# Altium project door-sensor-pcb-v3.PrjPcb
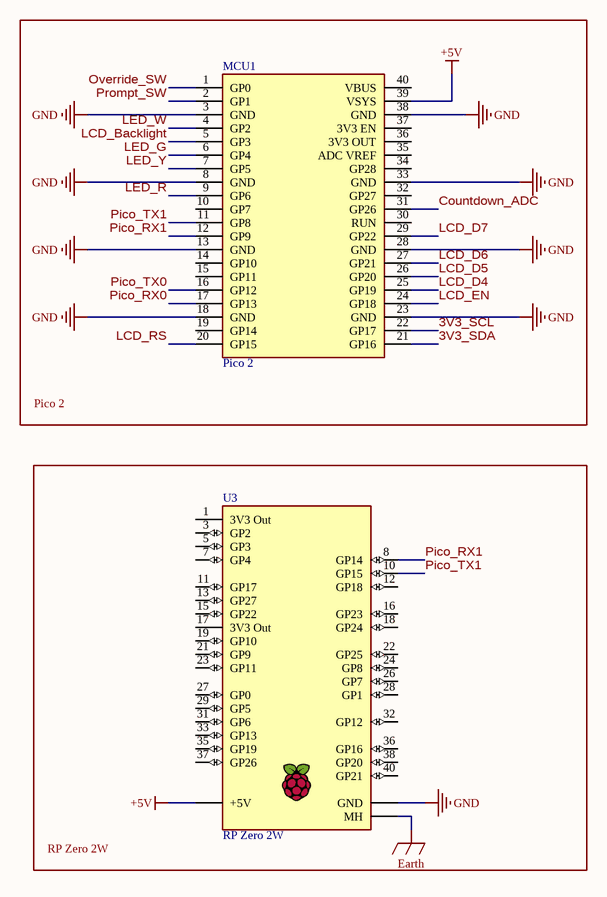
[diagram p0: Controllers.SchDoc]
5 sheets, 68 parts. Net scope: global (net labels, ports and power ports of the same name join across sheets).
Board file: Main.PcbDoc
Sheets:
  Controllers.SchDoc
  Power.SchDoc
  Connections.SchDoc
  Input Devices.SchDoc
  Output Devices.SchDoc

## Sheet Controllers.SchDoc
size A; SheetNumber: 1; SheetTotal: 5

### Parts
MCU1  Pico 2  [[Pi] Pico 2]
U3  RP Zero 2W  [[Pi] Zero 2W]

### Blocks framed on the sheet
Pico 2: MCU1
RP Zero 2W: U3

### Nets
+5V: MCU1.39(VSYS) U3.+5V
Earth: U3.MH
GND: MCU1.3(GND) MCU1.8(GND) MCU1.13(GND) MCU1.18(GND) MCU1.23(GND) MCU1.28(GND) MCU1.33(GND) MCU1.38(GND) U3.GND
3V3_SCL: MCU1.22(GP17)
3V3_SDA: MCU1.21(GP16)
Countdown_ADC: MCU1.31(GP26)
LCD_Backlight: MCU1.5(GP3)
LCD_D4: MCU1.25(GP19)
LCD_D5: MCU1.26(GP20)
LCD_D6: MCU1.27(GP21)
LCD_D7: MCU1.29(GP22)
LCD_EN: MCU1.24(GP18)
LCD_RS: MCU1.20(GP15)
LED_G: MCU1.6(GP4)
LED_R: MCU1.9(GP6)
LED_W: MCU1.4(GP2)
LED_Y: MCU1.7(GP5)
Override_SW: MCU1.1(GP0)
Pico_RX0: MCU1.17(GP13)
Pico_RX1: MCU1.12(GP9) U3.8(GP14)
Pico_TX0: MCU1.16(GP12)
Pico_TX1: MCU1.11(GP8) U3.10(GP15)
Prompt_SW: MCU1.2(GP1)

Not connected (* = marked no-connect by the designer): MCU1 10(GP7) 14(GP10) 15(GP11) 19(GP14) 30(RUN) 32(GP27) 34(GP28) 35(ADC_VREF) 36(3V3_OUT) 37(3V3_EN) 40(VBUS); U3 1(3V3_Out) 3(GP2) 5(GP3) 7(GP4) 11(GP17) 12(GP18) 13(GP27) 15(GP22) 16(GP23) 17(3V3_Out) 18(GP24) 19(GP10) 21(GP9) 22(GP25) 23(GP11) 24(GP8) 26(GP7) 27(GP0) 28(GP1) 29(GP5) 31(GP6) 32(GP12) 33(GP13) 35(GP19) 36(GP16) 37(GP26) 38(GP20) 40(GP21)

### Library data of the parts
MCU1 = [Pi] Pico 2: SC1631; Supplier 1: DigiKey; Supplier Part Number 1: 2648-SC1631TR-ND
U3 = [Pi] Zero 2W

## Sheet Power.SchDoc
size A; SheetNumber: 2; SheetTotal: 5
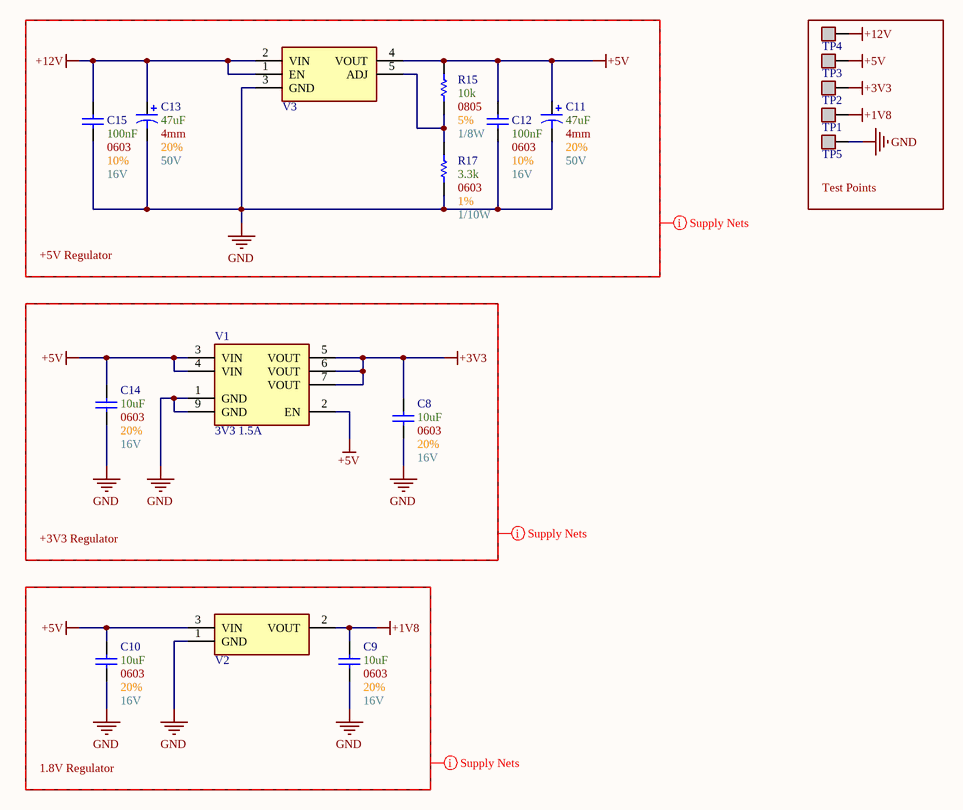
[diagram p1: Power.SchDoc]

### Parts
C8  Max Voltage: 16V  Size Package: 0603  Tolerance: 20%  Capacitance: 10uF  [[Cap] SMD 0603]  (hidden comment: [Cap] 0603 10uF 20% 16V)
C9  Max Voltage: 16V  Size Package: 0603  Tolerance: 20%  Capacitance: 10uF  [[Cap] SMD 0603]  (hidden comment: [Cap] 0603 10uF 20% 16V)
C10  Max Voltage: 16V  Size Package: 0603  Tolerance: 20%  Capacitance: 10uF  [[Cap] SMD 0603]  (hidden comment: [Cap] 0603 10uF 20% 16V)
C11  Max Voltage: 50V  Size Package: 4mm  Tolerance: 20%  Capacitance: 47uF  [[Cap] SMD Polarized, 4mm]  (hidden comment: [Cap] 4mm 47uF 20% 50V)
C12  Max Voltage: 16V  Size Package: 0603  Tolerance: 10%  Capacitance: 100nF  [[Cap] SMD 0603]  (hidden comment: [Cap] 0603 0.1uF 10% 16V)
C13  Max Voltage: 50V  Size Package: 4mm  Tolerance: 20%  Capacitance: 47uF  [[Cap] SMD Polarized, 4mm]  (hidden comment: [Cap] 4mm 47uF 20% 50V)
C14  Max Voltage: 16V  Size Package: 0603  Tolerance: 20%  Capacitance: 10uF  [[Cap] SMD 0603]  (hidden comment: [Cap] 0603 10uF 20% 16V)
C15  Max Voltage: 16V  Size Package: 0603  Tolerance: 10%  Capacitance: 100nF  [[Cap] SMD 0603]  (hidden comment: [Cap] 0603 0.1uF 10% 16V)
R15  Wattage: 1/8W  Tolerance: 5%  Resistance: 10k  Size Package: 0805  [[Res] SMD 0603]  (hidden comment: [10k] SMD 0603 1% 1/8W)
R17  Wattage: 1/10W  Tolerance: 1%  Resistance: 3.3k  Size Package: 0603  [[Res] SMD 0603]  (hidden comment: [3.3k] SMD 0603 1% 1/10W)
TP1  [THM] Thru-Hole  [[THM] White]  (value not drawn)
TP2  [THM] Thru-Hole  [[THM] White]  (value not drawn)
TP3  [THM] Thru-Hole  [[THM] White]  (value not drawn)
TP4  [THM] Thru-Hole  [[THM] White]  (value not drawn)
TP5  [THM] Thru-Hole  [[THM] White]  (value not drawn)
V1  3V3 1.5A  [[Linear] 3V3 1.5A]
V2  [Linear] 1.8V 1A  [[Linear] 1.8V 1A]  (value not drawn)
V3  [Linear] 1.25-25V 3A  [[Linear] 1.25-25V 3A]  (value not drawn)

### Blocks framed on the sheet
+5V Regulator: C11-C13 C15 R15 R17 V3
Test Points: TP1-TP5
+3V3 Regulator: C8 C14 V1
1.8V Regulator: C9 C10 V2

### Nets
+1V8: C9.2 TP1.1 V2.2(VOUT)
+3V3: C8.2 TP2.1 V1.5(VOUT) V1.6(VOUT) V1.7(VOUT)
+5V: C10.2 C11.1 C12.2 C14.2 R15.2 TP3.1 V1.2(EN) V1.3(VIN) V1.4(VIN) V2.3(VIN) V3.4(VOUT)
+12V: C13.1 C15.2 TP4.1 V3.1(EN) V3.2(VIN)
GND: C8.1 C9.1 C10.1 C11.2 C12.1 C13.2 C14.1 C15.1 R17.1 TP5.1 V1.1(GND) V1.9(GND) V2.1(GND) V3.3(GND)
NetR15_1: R15.1 R17.2 V3.5(ADJ)

### Layout directives
net class Supply_Nets: +1V8, +3V3, +5V, +12V, GND

### Library data of the parts
C8-C10 C14 = [Cap] 0603 10uF 20% 16V: GRM188C81C106MA73D; Supplier 1: DigiKey; Supplier Part Number 1: 490-7198-1-ND
C11 C13 = [Cap] 4mm 47uF 20% 50V: EEE-FN1A470UR; Supplier 1: DigiKey; Supplier Part Number 1: 10-EEE-FN1A470URCT-ND
C12 C15 = [Cap] 0603 0.1uF 10% 16V: CC0603KRX7R7BB104; Supplier 1: DigiKey; Supplier Part Number 1: 311-1088-6-ND
R15 = [10k] SMD 0603 1% 1/8W: RC0805JR-0710KL; Supplier 1: DigiKey; Supplier Part Number 1: 311-10KARCT-ND
R17 = [3.3k] SMD 0603 1% 1/10W: RC0603FR-073K3L; Supplier 1: DigiKey; Supplier Part Number 1: 311-3.30KHRCT-ND
TP1-TP5 = [THM] Thru-Hole: 5012; Supplier 1: DigiKey; Supplier Part Number 1: 36-5012-ND
V1 = [Linear] 3V3 1.5A: AP7362A-33SP-13; Supplier 1: DigiKey; Supplier Part Number 1: AP7362A-33SP-13DICT-ND
V2 = [Linear] 1.8V 1A: NCP1117IST18T3G
V3 = [Linear] 1.25-25V 3A: MIC29302WT; Supplier 1: DigiKey; Supplier Part Number 1: 576-1124-ND

## Sheet Connections.SchDoc
size A; SheetNumber: 3; SheetTotal: 5
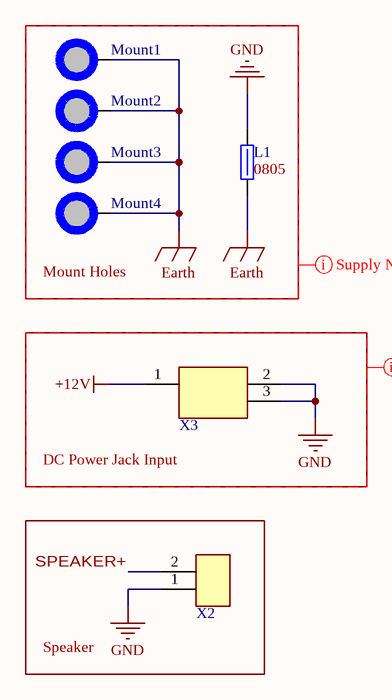
[diagram p2: Connections.SchDoc]

### Parts
L1  Size Package: 0805  [[Ferrite] SMD 0805]  (hidden comment: 652-MH2029-300Y)
Mount1  M3 Mount Hole  [[Mount] M3 Mount Hole]  (value not drawn)  (no BOM)
Mount2  M3 Mount Hole  [[Mount] M3 Mount Hole]  (value not drawn)  (no BOM)
Mount3  M3 Mount Hole  [[Mount] M3 Mount Hole]  (value not drawn)  (no BOM)
Mount4  M3 Mount Hole  [[Mount] M3 Mount Hole]  (value not drawn)  (no BOM)
X2  2pin Screw Terminal  [[Screw Terminal] 2pin 5mm]  (value not drawn)
X3  [Barrel] DC Jack 2mmID  [[Barrel] DC Jack]  (value not drawn)

### Blocks framed on the sheet
Mount Holes: L1 Mount1-Mount4
DC Power Jack Input: X3
Speaker: X2

### Nets
+12V: X3.1(Pin)
Earth: L1.1 Mount1.1 Mount2.1 Mount3.1 Mount4.1
GND: L1.2 X2.1 X3.2(Barrel) X3.3(Barrel)
SPEAKER+: X2.2

### Layout directives
net class Supply_Nets: +12V, Earth, GND

### Library data of the parts
L1 = [Ferrite] SMD 0805 3A 30ohm: Res @ Freq: 30 @ 100MHz; Supplier 1: DigiKey; Supplier Part Number 1: MH2029-300YCT-ND
Mount1-Mount4 = [Mount] M3 Mount Hole: Place at least 4.5mm from board edge. Plated.
X2 = [Screw Terminal] 2pin: TB002-500-02BE; Supplier 1: DigiKey; Supplier Part Number 1: 102-6145-ND
X3 = [Barrel] DC Jack 2mmID: PJ-102A; Supplier 1: DigiKey; Supplier Part Number 1: CP-102A-ND

## Sheet Input Devices.SchDoc
size A; SheetNumber: 4; SheetTotal: 5
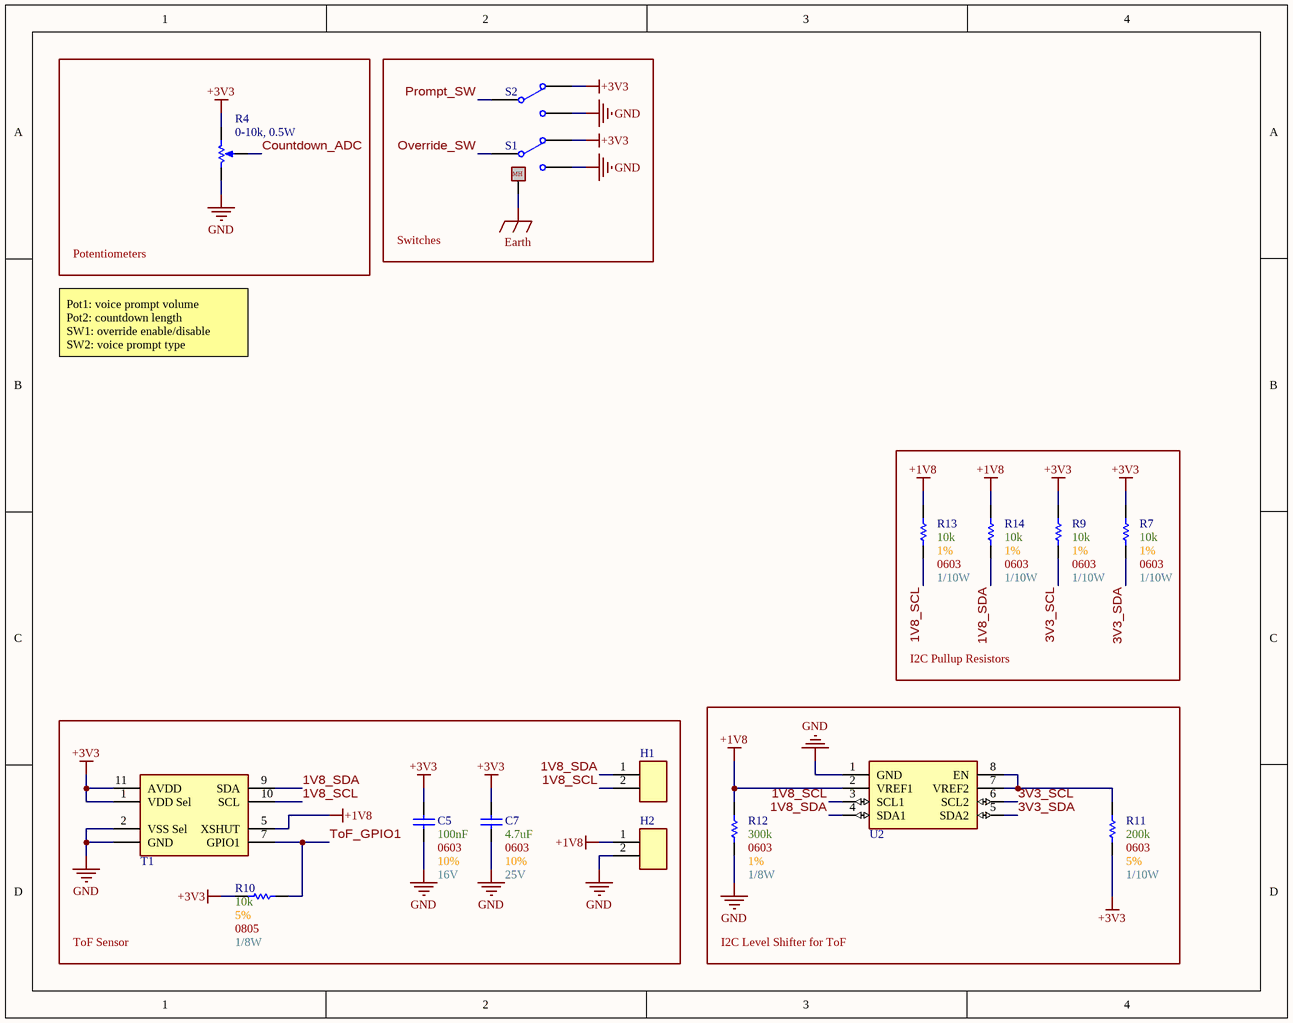
[diagram p3: Input Devices.SchDoc]

### Parts
C5  Max Voltage: 16V  Size Package: 0603  Tolerance: 10%  Capacitance: 100nF  [[Cap] SMD 0603]  (hidden comment: [Cap] 0603 0.1uF 10% 16V)
C7  Max Voltage: 25V  Size Package: 0603  Tolerance: 10%  Capacitance: 4.7uF  [[Cap] SMD 0603]  (hidden comment: [Cap] 0603 4.7uF 10% 25V)
H1  1x2 Header  [[Header] 1x2 Male]  (value not drawn)
H2  1x2 Header  [[Header] 1x2 Male]  (value not drawn)
R4  0-10k, 0.5W  [[Potentiometer] 10k 0.5W (2)]
R7  Wattage: 1/10W  Tolerance: 1%  Resistance: 10k  Size Package: 0603  [[Res] SMD 0603]  (hidden comment: [10k] SMD 0603 1% 1/8W)
R9  Wattage: 1/10W  Tolerance: 1%  Resistance: 10k  Size Package: 0603  [[Res] SMD 0603]  (hidden comment: [10k] SMD 0603 1% 1/8W)
R10  Wattage: 1/8W  Tolerance: 5%  Resistance: 10k  Size Package: 0805  [[Res] SMD 0603]  (hidden comment: [10k] SMD 0603 1% 1/8W)
R11  Wattage: 1/10W  Tolerance: 5%  Resistance: 200k  Size Package: 0603  [[Res] SMD 0603]  (hidden comment: [200k] SMD 0603 1% 1/10W)
R12  Wattage: 1/8W  Tolerance: 1%  Resistance: 300k  Size Package: 0603  [[Res] SMD 0603]  (hidden comment: [300k] SMD 0603 1% 1/10W)
R13  Wattage: 1/10W  Tolerance: 1%  Resistance: 10k  Size Package: 0603  [[Res] SMD 0603]  (hidden comment: [10k] SMD 0603 1% 1/8W)
R14  Wattage: 1/10W  Tolerance: 1%  Resistance: 10k  Size Package: 0603  [[Res] SMD 0603]  (hidden comment: [10k] SMD 0603 1% 1/8W)
S1  [SPDT] Toggle  [[SPDT] Toggle]  (value not drawn)
S2  [SPDT] Slide Switch  [[SPDT] Slide Switch]  (value not drawn)
T1  [ToF] VL53L1X  [[ToF] VL53L1X]  (value not drawn)
U2  [Level Shifter] I2C Level Shifter  [[Level Shifter] I2C Level Shifter]  (value not drawn)

### Blocks framed on the sheet
Potentiometers: R4
Switches: S1 S2
I2C Pullup Resistors: R7 R9 R13 R14
ToF Sensor: C5 C7 H1 H2 R10 T1
I2C Level Shifter for ToF: R11 R12 U2

### Nets
+1V8: H2.1 R12.2 R13.2 R14.2 T1.5(XSHUT) U2.2(VREF1)
+3V3: C5.2 C7.2 R4.1(TOP) R7.2 R9.2 R10.2 R11.1 S1.3 S2.3 T1.1(VDD_Sel) T1.11(AVDD)
Earth: S1.X(Mount_Hole)
GND: C5.1 C7.1 H2.2 R4.3(BOT) R12.1 S1.1 S2.1 T1.2(VSS_Sel) T1.GND U2.1(GND)
1V8_SCL: H1.2 R13.1 T1.10(SCL) U2.3(SCL1)
1V8_SDA: H1.1 R14.1 T1.9(SDA) U2.4(SDA1)
3V3_SCL: R9.1 U2.6(SCL2)
3V3_SDA: R7.1 U2.5(SDA2)
Countdown_ADC: R4.2(TAP)
Override_SW: S1.2
Prompt_SW: S2.2
ToF_GPIO1: R10.1 T1.7(GPIO1)
NetR11_2: R11.2 U2.7(VREF2) U2.8(EN)

### Notes on the sheet
- Pot1: voice prompt volume
  Pot2: countdown length
  SW1: override enable/disable
  SW2: voice prompt type
- (in symbol [SPDT] Toggle) MH

### Library data of the parts
C5 = [Cap] 0603 0.1uF 10% 16V: CC0603KRX7R7BB104; Supplier 1: DigiKey; Supplier Part Number 1: 311-1088-6-ND
C7 = [Cap] 0603 4.7uF 10% 25V: GRM188R61E475KE11D; Supplier 1: DigiKey; Supplier Part Number 1: 490-7203-6-ND
H1 H2 = [Header] 1x2 Male: 2.54mm pitch
R4 = [Potentiometer] 10k 0.5W: 3386T-1-103LF; Supplier 1: DigiKey; Supplier Part Number 1: 118-3386T-1-103LF-ND
R7 R9 R13 R14 = [10k] SMD 0603 1% 1/8W: RMCF0603FT10K0; Supplier 1: DigiKey; Supplier Part Number 1: RMCF0603FT10K0DKR-ND
R10 = [10k] SMD 0603 1% 1/8W: RC0805JR-0710KL; Supplier 1: DigiKey; Supplier Part Number 1: 311-10KARCT-ND
R11 = [200k] SMD 0603 1% 1/10W: RC0603JR-07200KL; Supplier 1: DigiKey; Supplier Part Number 1: 311-200KGRCT-ND
R12 = [300k] SMD 0603 1% 1/10W: CRCW0603300KFKEA; Supplier 1: DigiKey; Supplier Part Number 1: 541-300KHCT-ND
S1 = [SPDT] Toggle: ANT11TFHQE; Supplier 1: DigiKey; Supplier Part Number 1: 2449-ANT11TFHQE-ND
S2 = [SPDT] Slide Switch: 09.03290.01; Supplier 1: DigiKey; Supplier Part Number 1: 1948-1087-ND
T1 = [ToF] VL53L1X: VL53L1CXV0FY/1; Supplier 1: DigiKey; Supplier Part Number 1: 497-17764-1-ND
U2 = [Level Shifter] I2C Level Shifter: PCA9306DCTR; Supplier 1: DigiKey; Supplier Part Number 1: 296-18509-1-ND

## Sheet Output Devices.SchDoc
size A; SheetNumber: 5; SheetTotal: 5
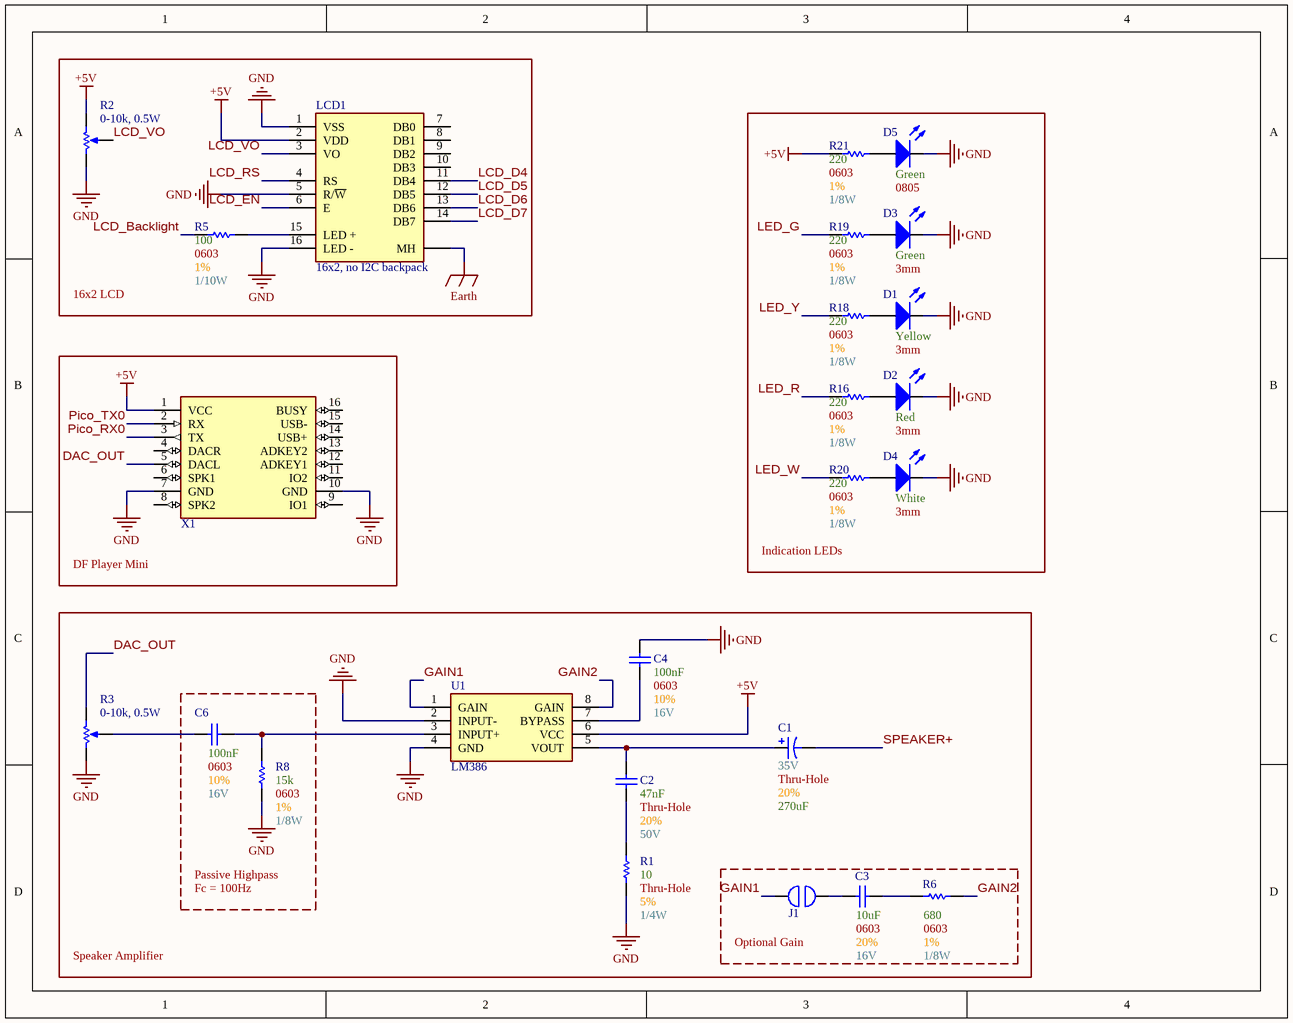
[diagram p4: Output Devices.SchDoc]

### Parts
C1  Max Voltage: 35V  Size Package: Thru-Hole  Tolerance: 20%  Capacitance: 270uF  [[Cap] Thru-Hole Polarized 8mm]  (hidden comment: [Cap] Thru-Hole 270uF 20% 35V)
C2  Max Voltage: 50V  Size Package: Thru-Hole  Tolerance: 20%  Capacitance: 47nF  [[Cap] Thru-Hole Nonpolarized Ceramic]  (hidden comment: [Cap] Thru-Hole 47nF 20% 50V)
C3  Max Voltage: 16V  Size Package: 0603  Tolerance: 20%  Capacitance: 10uF  [[Cap] SMD 0603]  (hidden comment: [Cap] 0603 10uF 20% 16V)
C4  Max Voltage: 16V  Size Package: 0603  Tolerance: 10%  Capacitance: 100nF  [[Cap] SMD 0603]  (hidden comment: [Cap] 0603 0.1uF 10% 16V)
C6  Max Voltage: 16V  Size Package: 0603  Tolerance: 10%  Capacitance: 100nF  [[Cap] SMD 0603]  (hidden comment: [Cap] 0603 0.1uF 10% 16V)
D1  Color: Yellow  Lens Diameter: 3mm  [[LED] Thru-Hole 3mm Yellow]  (hidden comment: [LED] Thru-Hole 3mm Yellow)
D2  Color: Red  Lens Diameter: 3mm  [[LED] Thru-Hole 3mm Red]  (hidden comment: [LED] Thru-Hole 3mm Red)
D3  Color: Green  Lens Diameter: 3mm  [[LED] Thru-Hole 3mm Green]  (hidden comment: [LED] Thru-Hole 3mm Green)
D4  Color: White  Lens Diameter: 3mm  [[LED] Thru-Hole 3mm White]  (hidden comment: [LED] Thru-Hole 3mm White)
D5  Color: Green  Size Package: 0805  [[LED] SMD 0805]  (hidden comment: [LED] SMD 0805 Green)
J1  [Jumper] Thru-Hole 2pin  [[Jumper] Thru-Hole 2pin]  (value not drawn)
LCD1  16x2, no I2C backpack  [[LCD] 16x2 Parallel]
R1  Size Package: Thru-Hole  Wattage: 1/4W  Tolerance: 5%  Resistance: 10  [[Res] Thru-Hole 1/4W]  (hidden comment: [10] Thru-Hole 5% 1/4W)
R2  0-10k, 0.5W  [[Potentiometer] 10k 0.5W (2)]
R3  0-10k, 0.5W  [[Potentiometer] 10k 0.5W (2)]
R5  Wattage: 1/10W  Tolerance: 1%  Resistance: 100  Size Package: 0603  [[Res] SMD 0603]  (hidden comment: [100] SMD 0603 1% 1/10W)
R6  Wattage: 1/8W  Tolerance: 1%  Resistance: 680  Size Package: 0603  [[Res] SMD 0603]  (hidden comment: [680] SMD 0603 1% 1/8W)
R8  Wattage: 1/8W  Tolerance: 1%  Resistance: 15k  Size Package: 0603  [[Res] SMD 0603]  (hidden comment: [15k] SMD 0603 1% 1/8W)
R16  Wattage: 1/8W  Tolerance: 1%  Resistance: 220  Size Package: 0603  [[Res] SMD 0603]  (hidden comment: [220] SMD 0603 1% 1/10W)
R18  Wattage: 1/8W  Tolerance: 1%  Resistance: 220  Size Package: 0603  [[Res] SMD 0603]  (hidden comment: [220] SMD 0603 1% 1/10W)
R19  Wattage: 1/8W  Tolerance: 1%  Resistance: 220  Size Package: 0603  [[Res] SMD 0603]  (hidden comment: [220] SMD 0603 1% 1/10W)
R20  Wattage: 1/8W  Tolerance: 1%  Resistance: 220  Size Package: 0603  [[Res] SMD 0603]  (hidden comment: [220] SMD 0603 1% 1/10W)
R21  Wattage: 1/8W  Tolerance: 1%  Resistance: 220  Size Package: 0603  [[Res] SMD 0603]  (hidden comment: [220] SMD 0603 1% 1/10W)
U1  LM386  [[Amp] LM386]
X1  [MP3] DFPlayer Mini MP3 Player  [[MP3] DFPlayer Mini MP3 Player]  (value not drawn)

### Blocks framed on the sheet
16x2 LCD: LCD1 R2 R5
Indication LEDs: D1-D5 R16 R18-R21
DF Player Mini: X1
Optional Gain: C3 J1 R6

### Nets
+5V: LCD1.2(VDD) R2.1(TOP) R21.1 U1.6(VCC) X1.1(VCC)
Earth: LCD1.MH
GND: C4.2 D1.2(Cathode) D2.2(Cathode) D3.2(Cathode) D4.2(Cathode) D5.2(Cathode) LCD1.1(VSS) LCD1.5(R/~{W}) LCD1.16(LED_-) R1.1 R2.3(BOT) R3.3(BOT) R8.1 U1.2(INPUT-) U1.4(GND) X1.7(GND) X1.10(GND)
DAC_OUT: R3.1(TOP) X1.5(DACL)
GAIN1: J1.1 U1.1(GAIN)
GAIN2: R6.2 U1.8(GAIN)
LCD_Backlight: R5.1
LCD_D4: LCD1.11(DB4)
LCD_D5: LCD1.12(DB5)
LCD_D6: LCD1.13(DB6)
LCD_D7: LCD1.14(DB7)
LCD_EN: LCD1.6(E)
LCD_RS: LCD1.4(RS)
LCD_VO: LCD1.3(VO) R2.2(TAP)
LED_G: R19.1
LED_R: R16.1
LED_W: R20.1
LED_Y: R18.1
Pico_RX0: X1.3(TX)
Pico_TX0: X1.2(RX)
SPEAKER+: C1.2
NetC1_1: C1.1 C2.2 U1.5(VOUT)
NetC2_1: C2.1 R1.2
NetC3_1: C3.1 J1.2
NetC3_2: C3.2 R6.1
NetC4_1: C4.1 U1.7(BYPASS)
NetC6_1: C6.1 R8.2 U1.3(INPUT+)
NetC6_2: C6.2 R3.2(TAP)
NetD1_1: D1.1(Anode) R18.2
NetD2_1: D2.1(Anode) R16.2
NetD3_1: D3.1(Anode) R19.2
NetD4_1: D4.1(Anode) R20.2
NetD5_1: D5.1(Anode) R21.2
NetLCD1_15: LCD1.15(LED_+) R5.2

Not connected (* = marked no-connect by the designer): LCD1 7(DB0) 8(DB1) 9(DB2) 10(DB3); X1 4(DACR) 6(SPK1) 8(SPK2) 9(IO1) 11(IO2) 12(ADKEY1) 13(ADKEY2) 14(USB+) 15(USB-) 16(BUSY)

### Notes on the sheet
- Passive Highpass
- Fc = 100Hz
- Speaker Amplifier

### Library data of the parts
C1 = [Cap] Thru-Hole 270uF 20% 35V: 35ZLH270MEFC8X16; Supplier 1: DigiKey; Supplier Part Number 1: 1189-1748-ND
C2 = [Cap] Thru-Hole 47nF 20% 50V: C317C473M5U5TA; Supplier 1: DigiKey; Supplier Part Number 1: 399-4246-ND
C3 = [Cap] 0603 10uF 20% 16V: GRM188C81C106MA73D; Supplier 1: DigiKey; Supplier Part Number 1: 490-7198-1-ND
C4 C6 = [Cap] 0603 0.1uF 10% 16V: CC0603KRX7R7BB104; Supplier 1: DigiKey; Supplier Part Number 1: 311-1088-6-ND
D1 = [LED] Thru-Hole 3mm Yellow: 151031YS05900; Supplier 1: DigiKey; Supplier Part Number 1: 732-5009-ND
D2 = [LED] Thru-Hole 3mm Red: 151031SS06000; Supplier 1: DigiKey; Supplier Part Number 1: 732-5006-ND
D3 = [LED] Thru-Hole 3mm Green: 151031VS06000; Supplier 1: DigiKey; Supplier Part Number 1: 732-5008-ND
D4 = [LED] Thru-Hole 3mm White: 151031VS06000; Supplier 1: DigiKey; Supplier Part Number 1: 1516-QBL7IW60D-WW-ND
D5 = [LED] SMD 0805 Green: LG R971-KN-1-0-20-R18; Supplier 1: DigiKey; Supplier Part Number 1: 475-LGR971-KN-1CT-ND
LCD1 = [LCD] 16x2 Parallel: Sunfounder
R1 = [10] Thru-Hole 5% 1/4W: CFR-25JT-52-10R; Supplier 1: DigiKey; Supplier Part Number 1: 13-CFR-25JT-52-10RCT-ND
R2 R3 = [Potentiometer] 10k 0.5W: 3386T-1-103LF; Supplier 1: DigiKey; Supplier Part Number 1: 118-3386T-1-103LF-ND
R5 = [100] SMD 0603 1% 1/10W: RC0603FR-07100RL; Supplier 1: DigiKey; Supplier Part Number 1: 311-100HRDKR-ND
R6 = [680] SMD 0603 1% 1/8W: CRCW0603680RFKEA; Supplier 1: DigiKey; Supplier Part Number 1: 541-680HCT-ND
R8 = [15k] SMD 0603 1% 1/8W: CRCW060315K0FKEA; Supplier 1: DigiKey; Supplier Part Number 1: 541-15.0KHCT-ND
R16 R18-R21 = [220] SMD 0603 1% 1/10W: CRGCQ0805F220R; Supplier 1: DigiKey; Supplier Part Number 1: A129741CT-ND
U1 = [Amp] LM386: LM386N-1/NOPB; Supplier 1: DigiKey; Supplier Part Number 1: 296-44414-5-ND
X1 = [MP3] DFPlayer Mini MP3 Player: DFR0299; Supplier 1: DigiKey; Supplier Part Number 1: 1738-1041-ND

## Nets that join several sheets
+1V8: Power (C9.2 TP1.1 V2.2), Input Devices (6 pins)
+3V3: Power (5 pins), Input Devices (11 pins)
+5V: Controllers (MCU1.39 U3.+5V), Power (11 pins), Output Devices (5 pins)
+12V: Power (5 pins), Connections (X3.1)
Earth: Controllers (U3.MH), Connections (5 pins), Input Devices (S1.X), Output Devices (LCD1.MH)
GND: Controllers (9 pins), Power (14 pins), Connections (L1.2 X2.1 X3.2 X3.3), Input Devices (10 pins), Output Devices (17 pins)
3V3_SCL: Controllers (MCU1.22), Input Devices (R9.1 U2.6)
3V3_SDA: Controllers (MCU1.21), Input Devices (R7.1 U2.5)
Countdown_ADC: Controllers (MCU1.31), Input Devices (R4.2)
LCD_Backlight: Controllers (MCU1.5), Output Devices (R5.1)
LCD_D4: Controllers (MCU1.25), Output Devices (LCD1.11)
LCD_D5: Controllers (MCU1.26), Output Devices (LCD1.12)
LCD_D6: Controllers (MCU1.27), Output Devices (LCD1.13)
LCD_D7: Controllers (MCU1.29), Output Devices (LCD1.14)
LCD_EN: Controllers (MCU1.24), Output Devices (LCD1.6)
LCD_RS: Controllers (MCU1.20), Output Devices (LCD1.4)
LED_G: Controllers (MCU1.6), Output Devices (R19.1)
LED_R: Controllers (MCU1.9), Output Devices (R16.1)
LED_W: Controllers (MCU1.4), Output Devices (R20.1)
LED_Y: Controllers (MCU1.7), Output Devices (R18.1)
Override_SW: Controllers (MCU1.1), Input Devices (S1.2)
Pico_RX0: Controllers (MCU1.17), Output Devices (X1.3)
Pico_TX0: Controllers (MCU1.16), Output Devices (X1.2)
Prompt_SW: Controllers (MCU1.2), Input Devices (S2.2)
SPEAKER+: Connections (X2.2), Output Devices (C1.2)